# Altium schematic sheet NB2_PSU.SchDoc: NB2DSK01 POWER SUPPLIES
size A4; Organization: Altium Limited.; Address1: Level 3, 12a Rodborough Rd; Address2: Frenchs Forest 2086; Address3: NSW; Address4: AUSTRALIA; DocumentNumber: 29; Revision: 6; SheetNumber: 29; SheetTotal: 64
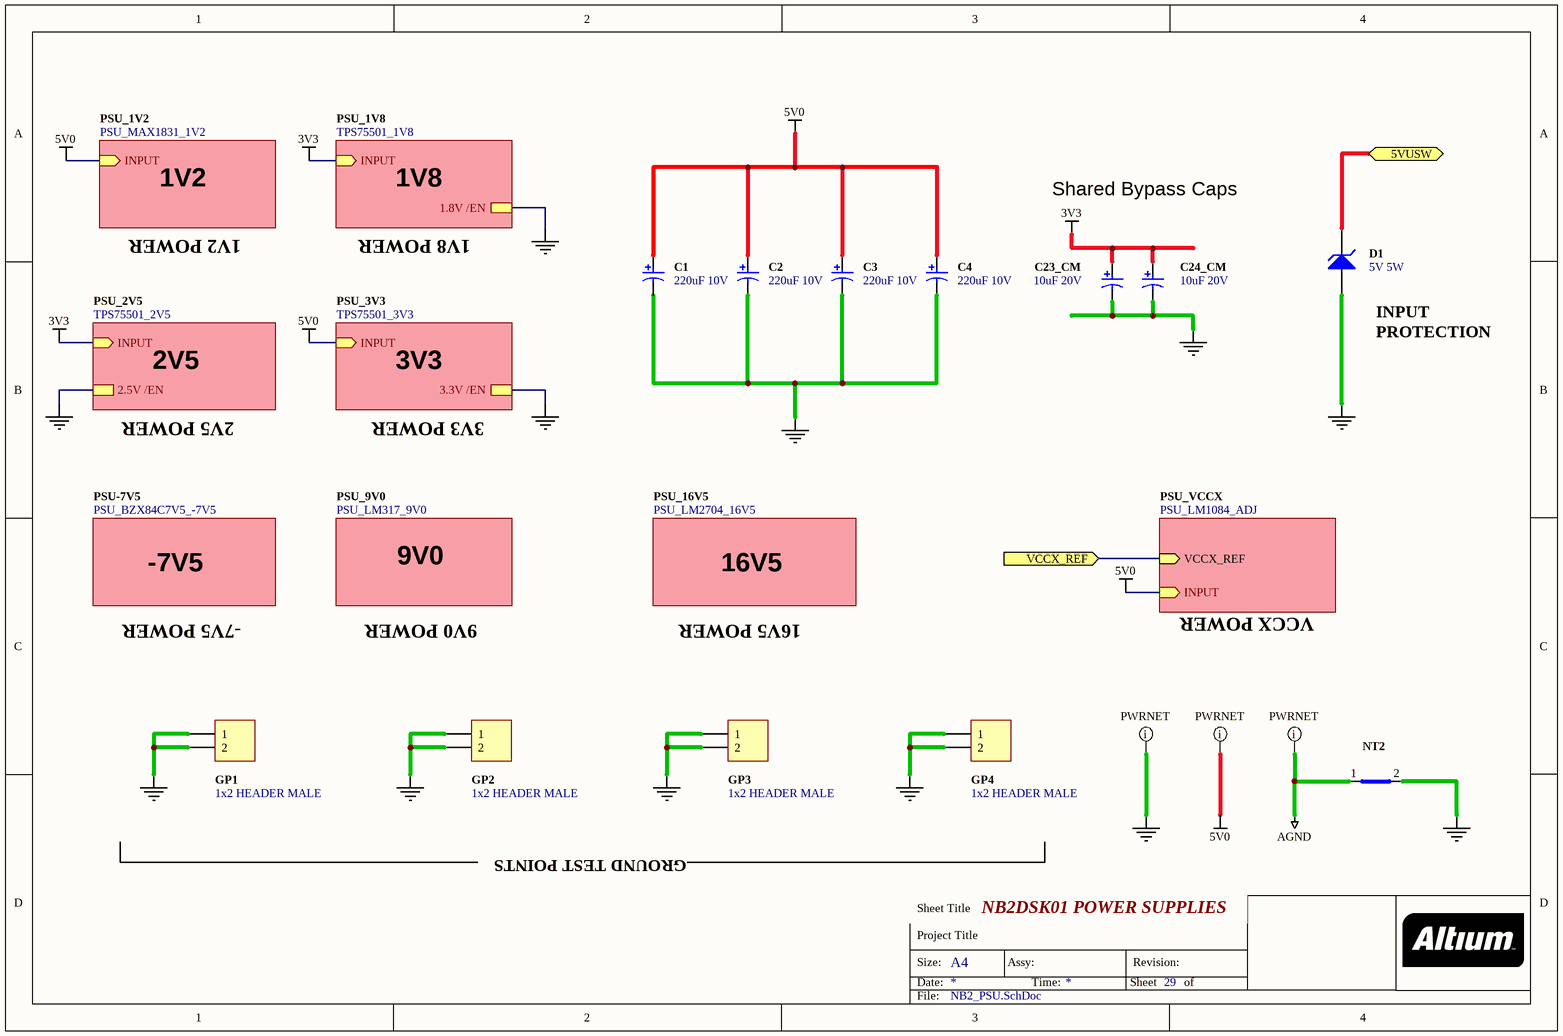
[diagram p0: NB2_PSU.SchDoc]

## Parts
C1  220uF 10V  [CAPC7343-STAR]
C2  220uF 10V  [CAPC7343-STAR]
C3  220uF 10V  [CAPC7343-STAR]
C4  220uF 10V  [CAPC7343-STAR]
C23_CM  10uF 20V  [CAPC3528-STAR]
C24_CM  10uF 20V  [CAPC3528-STAR]
D1  5V 5W  [DIOM8059]
GP1  1x2 HEADER MALE  [HDR1X2]
GP2  1x2 HEADER MALE  [HDR1X2]
GP3  1x2 HEADER MALE  [HDR1X2]
GP4  1x2 HEADER MALE  [HDR1X2]
NT2  Net Tie SMT2  [NETTIE-SMT2-31X51]  (value not drawn)  (net tie, no BOM)

## Sub-sheets
PSU-7V5 = PSU_BZX84C7V5_-7V5: no entries
PSU_1V2 = PSU_MAX1831_1V2: INPUT (in)
PSU_1V8 = TPS75501_1V8: 1.8V /EN, INPUT (in)
PSU_2V5 = TPS75501_2V5: 2.5V /EN, INPUT (in)
PSU_3V3 = TPS75501_3V3: 3.3V /EN, INPUT (in)
PSU_9V0 = PSU_LM317_9V0: no entries
PSU_16V5 = PSU_LM2704_16V5: no entries
PSU_VCCX = PSU_LM1084_ADJ: VCCX_REF (in), INPUT (in)

## Ports
5VUSW, VCCX_REF (in)

## Nets
3V3: C23_CM.1 C24_CM.1 ; sheet PSU_2V5/INPUT, sheet PSU_1V8/INPUT
5V0: C1.1 C2.1 C3.1 C4.1 ; sheet PSU_3V3/INPUT, sheet PSU_1V2/INPUT, sheet PSU_VCCX/INPUT
AGND: NT2.1(Net1)
GND: C1.2 C2.2 C3.2 C4.2 C23_CM.2 C24_CM.2 D1.1(A) GP1.1 GP1.2 GP2.1 GP2.2 GP3.1 GP3.2 GP4.1 GP4.2 NT2.2(Net2) ; sheet PSU_3V3/3.3V /EN, sheet PSU_2V5/2.5V /EN, sheet PSU_1V8/1.8V /EN
5VUSW: D1.2(K) ; port 5VUSW
VCCX_REF: port VCCX_REF, sheet PSU_VCCX/VCCX_REF

## Layout directives
net class PWRNET: 5V0, AGND, GND

## Notes on the sheet
- 1V2
- 1V2 POWER
- 1V8
- 1V8 POWER
- Shared Bypass Caps
- 2V5
- 3V3
- (near D1) INPUT
- PROTECTION
- 2V5 POWER
- 3V3 POWER
- -7V5
- 9V0
- 16V5
- -7V5 POWER
- 9V0 POWER
- 16V5 POWER
- VCCX POWER
- GROUND TEST POINTS
- Sheet Title
- Project Title
- Size:
- Date:
- A4
- Assy:
- Time:
- Sheet
- Revision:
- of
- File:

## Library data of the parts
C1-C4 = D-101-0088: Capacitor, Tantalum, 220uF 10% 10V MCCT-D (7343-31); Polarity: Polarized; Category: Capacitor; Capacitance: 220 uF; Mounting Technology: Surface Mount; Rated Voltage: 10 V; Status: Unreleased; Technology: Tantalum; Tolerance: 10 %
C23_CM C24_CM = D-101-0007: Capacitor, Tantalum, 10uF 10% 20V MCCT-B (3528); Polarity: Polarized; Category: Capacitor; Status: Production; Capacitance: 10 uF; Mounting Technology: Surface Mount; Rated Voltage: 20 V; Technology: Tantalum; Tolerance: 10 %
D1 = D-150-0001: Zener Diode, 5V 5W; Max Forward Current: mA; Rated Voltage: mV; Category: Diode-Zener; Mounting Technology: Surface Mount; Status: Production
GP1-GP4 = D-300-0020: Header IDC, 2 x 1 Pin Vertical 2.54mm Pitch (Non-Boxed, Male); Max Current: 3 A; Category: Connector; Connector type: Header; Mounting Technology: Through-Hole; Pin Count: 2; Status: Production
NT2 = D-002-0003: Net-Tie, Surface Mount, 2 x 1.6mm x 0.8mm SMT Pads - For 0.8mm Track; Category: Net-Tie; Status: Production